# Altium project Devre_2_Proje.PrjPcb
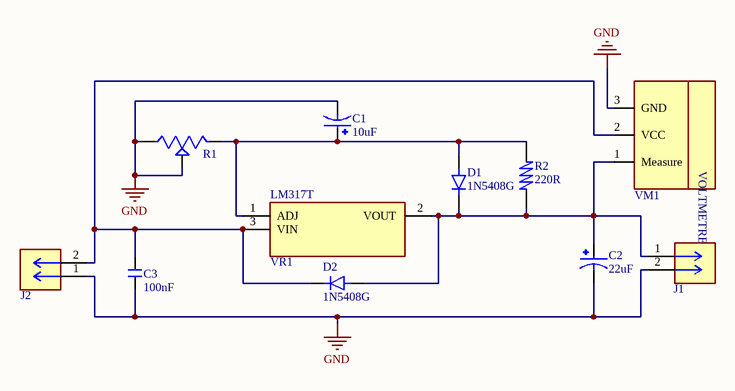
[diagram p0: Devre_2_Proje.SchDoc]
1 sheet, 11 parts. Net scope: global (net labels, ports and power ports of the same name join across sheets).
Board file: Devre_2_Proje.PcbDoc

## Sheet Devre_2_Proje.SchDoc
size A4; SheetNumber: 1; SheetTotal: 1

### Parts
C1  10uF  [CAP-ELEC]
C2  22uF  [CAP-ELEC]
C3  100nF  [CAP-CER-100nF]
D1  1N5408G  [DIODE_1N5408]
D2  1N5408G  [DIODE_1N5408]
J1  TERM BLK 1x2P 5.08mm  [Term_Block_5.08mm-1x2P]  (value not drawn)
J2  TERM BLK 1x2P 5.08mm  [Term_Block_5.08mm-1x2P]  (value not drawn)
R1  POT  [POT]  (value not drawn)
R2  220R  [RES-AXIAL-0.7]
VM1  Voltmetre  [Voltmetre]  (value not drawn)
VR1  LM317T  [LM317T]

### Nets
GND: C1.2 C2.2 C3.1 J1.2 J2.1 R1.1 R1.2 VM1.3(GND)
NetC1_1: C1.1 D1.A R1.3 R2.2 VR1.1(ADJ)
NetC2_1: C2.1 D1.C(K) D2.A J1.1 R2.1 VM1.1(Measure) VR1.2(VOUT)
NetC3_2: C3.2 D2.C(K) J2.2 VM1.2(VCC) VR1.3(VIN)

### Notes on the sheet
- (in symbol Voltmetre) VOLTMETRE

### Library data of the parts
C1 = CAP ELEC 10uF: CAP-ELEC 10 uF
C2 = CAP ELEC 22uF: CAP-ELEC 22 uF
C3 = CAP CER: 0.1uF (100nF)
D1 D2 = 1N5408G: 3A, 1000V, Standard Rectifier; MF: Taiwan Semiconductor; SnapEDA_Link: https://www.snapeda.com/parts/1N5408G/taiwan/view-part/?ref=snap; Package: DO-201AD Taiwan Semiconductor; Value: *; MP: 1N5408G; Check_prices: https://www.snapeda.com/parts/1N5408G/taiwan/view-part/?ref=eda
J1 J2 = TERM BLK 1x2P 5.08mm: 17.5A 1x2P 2P 400V 5.08mm Board Side/Plug Green 2 1 Through Hole,P=5.08mm Headers, Plugs and Sockets RoHS; Value: Term Block; MF: Phoenix Contact; MP: MKDS 1,5/ 2-5,08; Package: Through Hole,P=5.08mm; Voltage Rating (Max): 400V; Current Rating: 17.5A
R1 = POT: 16mm Rotary Potentiometers; MF: Kls electronics; MP: WH148-1A-2-18T-L20; SnapEDA_Link: https://www.snapeda.com/parts/WH148-1A-2-18T-L20/Kls+electronics/view-part/?ref=snap; Package: Package; Value: *; Check_prices: https://www.snapeda.com/parts/WH148-1A-2-18T-L20/Kls+electronics/view-part/?ref=eda
R2 = RES 220R: RES 220R 2W / AXIAL-0.7
VM1 = Voltmetre: Voltmetre 3 kablolu 0-100V
VR1 = LM317T: Linear Voltage Regulator IC Positive Adjustable 1 Output 1.5A TO-220AB; MF: onsemi; SnapEDA_Link: https://www.snapeda.com/parts/LM317T/Onsemi/view-part/?ref=snap; Package: TO-220-3 ON; Value: *; MP: LM317T; Check_prices: https://www.snapeda.com/parts/LM317T/Onsemi/view-part/?ref=eda